# EAGLE schematic Castle_Touch_Adapter3.3 (EAGLE 9.3.0)
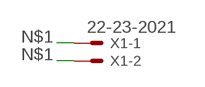
[diagram p0: schematic, sheet 1]

## Parts
X1  22-23-2021  [22-23-2021]

## Nets
N$1: X1.1 X1.2

## Library data of the parts
X1 = con-molex:22-23-2021: .100" (2.54mm) Center Header - 2 Pin; MF: MOLEX; MPN: 22-23-2021; OC_FARNELL: 1462926; OC_NEWARK: 25C3832